# Altium schematic sheet x-IMU3-SA-Sync.SchDoc
size A4; SheetNumber: 1; SheetTotal: 1
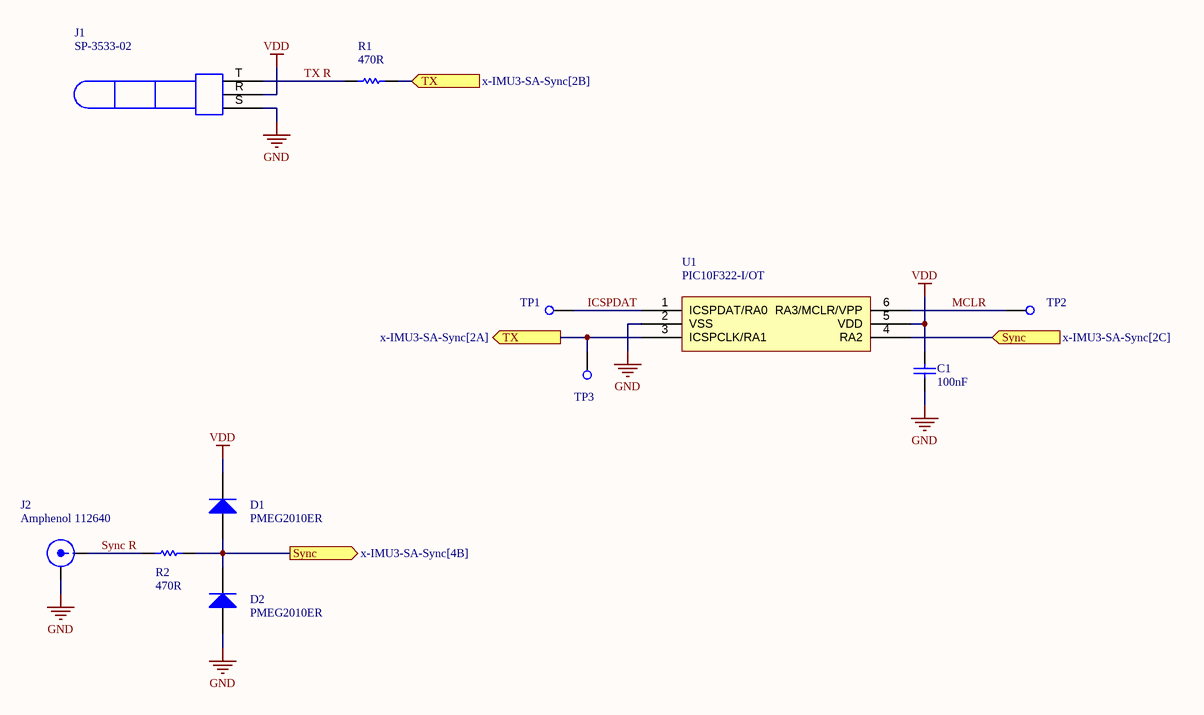
[diagram p0: x-IMU3-SA-Sync.SchDoc]

## Parts
C1  100nF  [Capacitor 0402]
D1  PMEG2010ER  [SOD-123]
D2  PMEG2010ER  [SOD-123]
J1  SP-3533-02  [SP-3533-02]
J2  Amphenol 112640  [Amphenol 112640]
R1  470R  [Resistor 0402]
R2  470R  [Resistor 0402]
TP1  Test Point  [Test Point 1mm]  (value not drawn)
TP2  Test Point  [Test Point 1mm]  (value not drawn)
TP3  Test Point  [Test Point 1mm]  (value not drawn)
U1  PIC10F322-I/OT  [SOT-23-6]

## Ports
Sync (in, see x-IMU3-SA-Sync[2C]), Sync (out, see x-IMU3-SA-Sync[4B]), TX (in, see x-IMU3-SA-Sync[2B]), TX (out, see x-IMU3-SA-Sync[2A])

## Nets
GND: C1.1 D2.A J1.S J2.Shield U1.2(VSS)
VDD: C1.2 D1.K J1.R U1.5(VDD)
ICSPDAT: TP1.1 U1.1(ICSPDAT/RA0)
MCLR: TP2.1 U1.6(RA3/MCLR/VPP)
Sync: D1.A D2.K R2.2 U1.4(RA2) ; port Sync
Sync R: J2.Signal R2.1
TX: R1.2 TP3.1 U1.3(ICSPCLK/RA1) ; port TX
TX R: J1.T R1.1

## Notes on the sheet
- TITLE
- SIZE
- A4
- VARIANT
- PROJECT
- SHEET
- VERSION
- OF
- AUTHOR
- DATE

## Library data of the parts
C1 = Capacitor
D1 D2 = Diode
J2 = BNC
R1 R2 = Resistor